# EAGLE schematic sample (EAGLE 7.5.0)
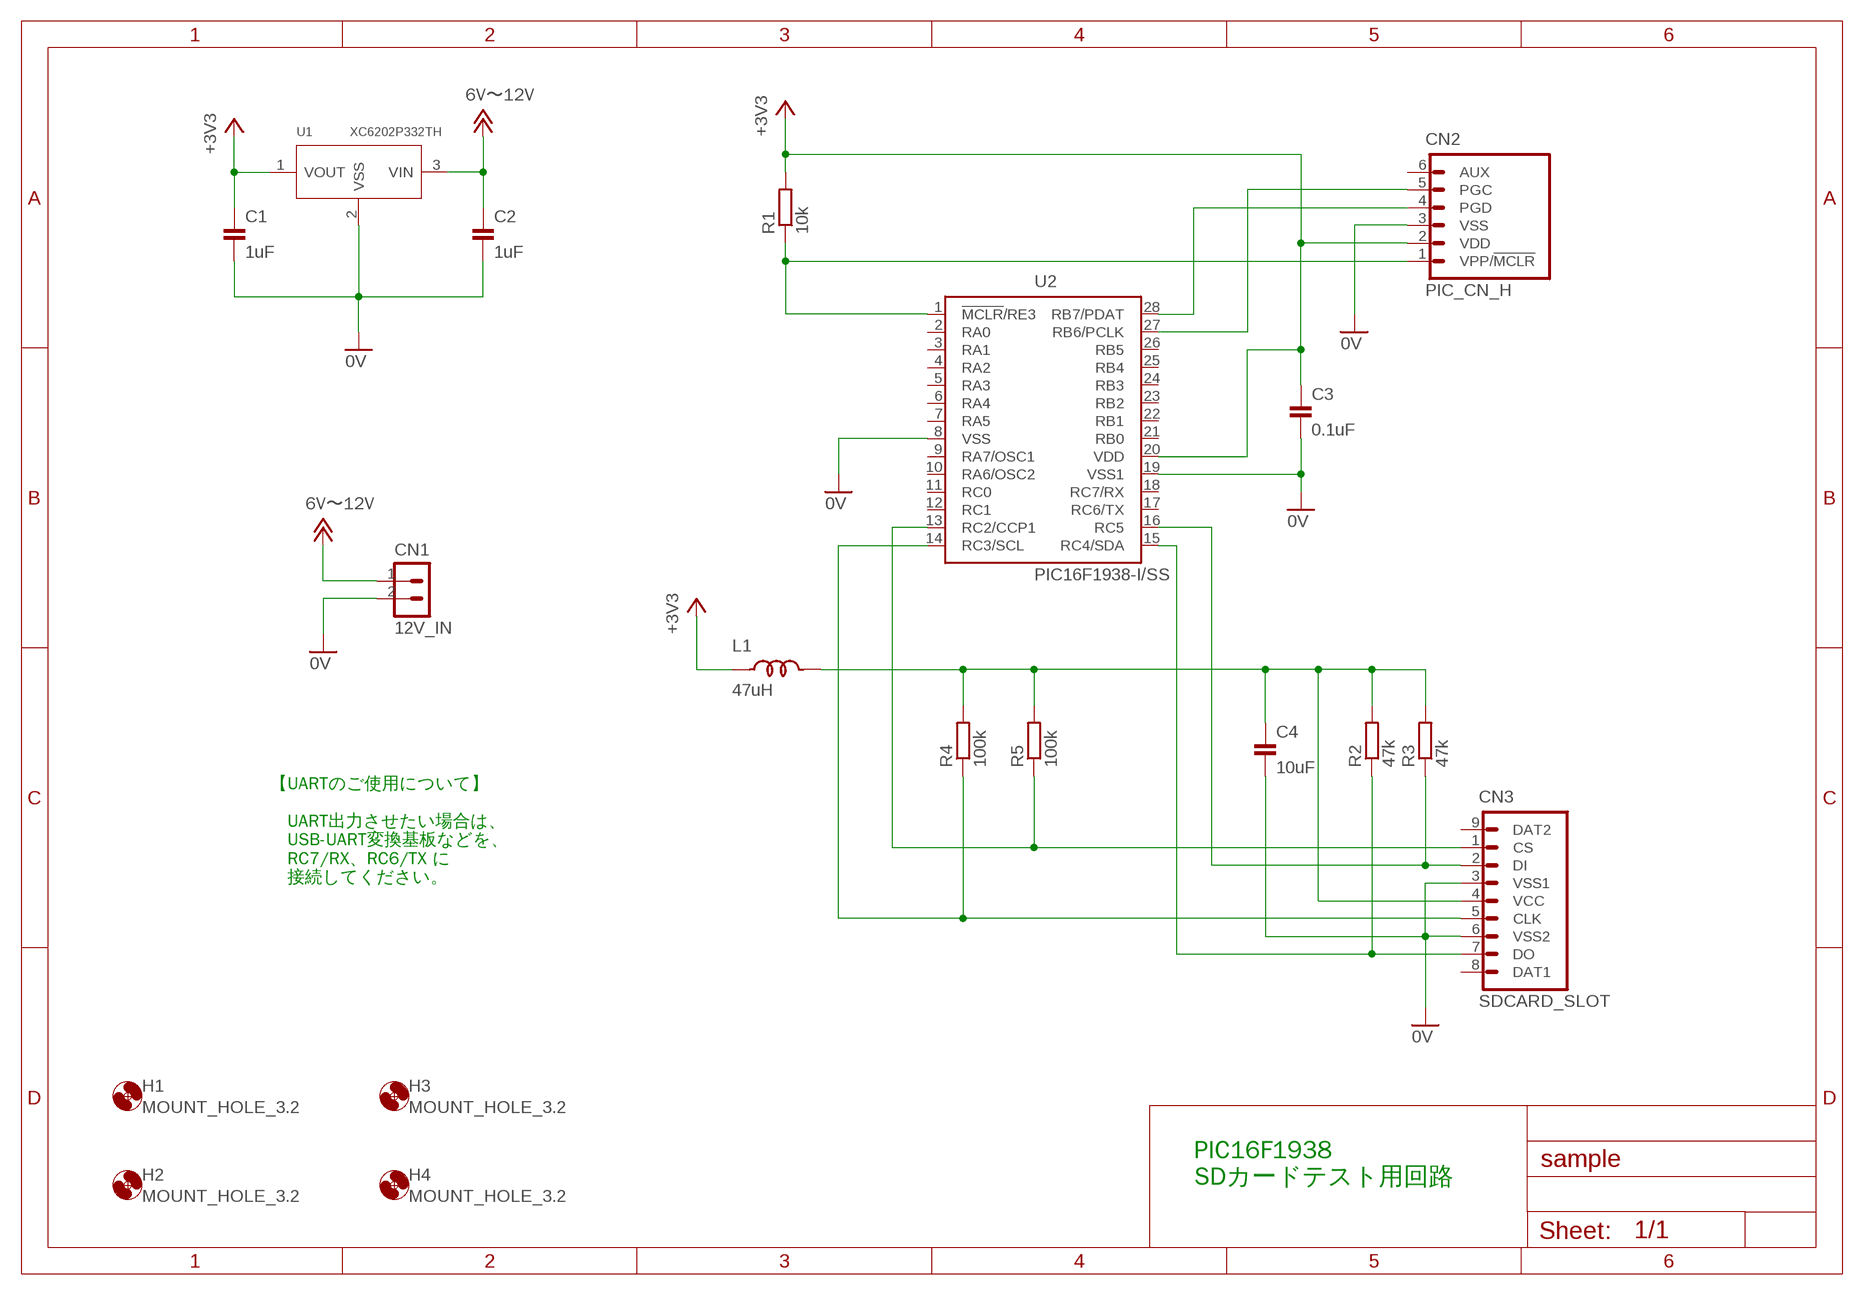
[diagram p0: schematic, sheet 1]

## Parts
C1  1uF  CAP_200MIL  [CAP_200MIL]
C2  1uF  CAP_200MIL  [CAP_200MIL]
C3  0.1uF  CAP_200MIL  [CAP_200MIL]
C4  10uF  CAP_200MIL  [CAP_200MIL]
CN1  12V_IN  CONN_2PIN-L  [HEADER_L_2PIN]
CN2  PIC_CN_H  [HEADER_6PIN]
CN3  SDCARD_SLOT  [SDCARD_SLOT]
H1  MOUNT_HOLE_3.2  [3,2]
H2  MOUNT_HOLE_3.2  [3,2]
H3  MOUNT_HOLE_3.2  [3,2]
H4  MOUNT_HOLE_3.2  [3,2]
L1  47uH  TC5026-22UH-060  [TOROID_COIL-300MIL]
R1  10k  RESISTOR_300MIL  [RESISTOR_0207_300MIL]
R2  47k  RESISTOR_300MIL  [RESISTOR_0207_300MIL]
R3  47k  RESISTOR_300MIL  [RESISTOR_0207_300MIL]
R4  100k  RESISTOR_300MIL  [RESISTOR_0207_300MIL]
R5  100k  RESISTOR_300MIL  [RESISTOR_0207_300MIL]
U1  XC6202P332TH  [TO92-LINE]
U2  PIC16F1938-I/SS  [SSOP28]

## Nets
0V: C1.2 C2.2 C3.2 C4.2 CN1.2 CN2.3(VSS) CN3.3(VSS1) CN3.6(VSS2) U1.2(VSS) U2.8(VSS) U2.19(VSS1)
+3V3: C1.1 C3.1 CN2.2(VDD) L1.1 R1.2 U1.1(VOUT) U2.20(VDD)
+12V: C2.1 CN1.1 U1.3(VIN) ; supply symbol labelled 6V〜12V
N$1: C4.1 CN3.4(VCC) L1.2 R2.2 R3.2 R4.2 R5.2
N$2: CN2.4(PGD) U2.28(RB7/PDAT)
N$3: CN2.1(VPP/!MCLR) R1.1 U2.1(!MCLR!/RE3)
N$4: CN2.5(PGC) U2.27(RB6/PCLK)
N$5: CN3.7(DO) R2.1 U2.15(RC4/SDA)
N$6: CN3.2(DI) R3.1 U2.16(RC5)
N$7: CN3.1(CS) R5.1 U2.13(RC2/CCP1)
N$8: CN3.5(CLK) R4.1 U2.14(RC3/SCL)
Unconnected: CN2.6(AUX) CN3.8(DAT1) CN3.9(DAT2) U2.2(RA0) U2.3(RA1) U2.4(RA2) U2.5(RA3) U2.6(RA4) U2.7(RA5) U2.9(RA7/OSC1) U2.10(RA6/OSC2) U2.11(RC0) U2.12(RC1) U2.17(RC6/TX) U2.18(RC7/RX) U2.21(RB0) U2.22(RB1) U2.23(RB2) U2.24(RB3) U2.25(RB4) U2.26(RB5)

## Notes on the sheet
- 【UARTのご使用について】
  
  　UART出力させたい場合は、
  　USB-UART変換基板などを、
  　RC7/RX、RC6/TX に
  　接続してください。
- PIC16F1938
  SDカードテスト用回路

## Library data of the parts
C1-C4 = Parts:CAP: コンデンサー
CN1 = Connectors:CONN_2PIN
CN2 = Connectors:PIC_CN: PICKit 3 インターフェースピン
CN3 = PartsForProto:SDCARD_SLOT: SDカードスロット
H1-H4 = Generic:MOUNT_HOLE
L1 = Parts:TC5026-22UH-060: 電力用インダクタ 公称インダクタンス：22μH±10％ （＠1KHz/0.25V） 直流抵抗：650mΩ 定格電流：6A 寸法：φD=15、H=6.5、φd=0.6、L=8（単位：mm）
R1-R5 = Parts:RESISTOR: 抵抗器
U1 = Parts:XC6202*: 低損失ＣＭＯＳ三端子レギュレーター ・定格出力：５Ｖ ・最大出力電流：１５０ｍＡ以上 ・入力最大電圧：２０Ｖ ・入出力電圧差： ０．２Ｖ（３０ｍＡ時） ０．６７Ｖ（１００ｍＡ時） ・低消費電流：１０μＡ
U2 = Parts:PIC16F1938*: 28-Pin フラッシュ マイクロコントローラ ■プログラムメモリサイズ : 28K words ■EEPROMサイズ : 256 bytes ■RAMサイズ : 1K bytes ■I/O数 : 25 ■電圧 - 電源 : 1.8-5.5V ■動作温度 : -40°C～85°C